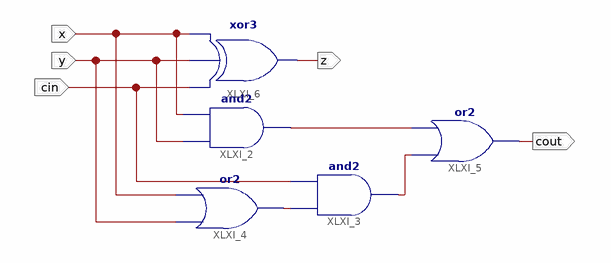
[diagram p0: schematic sheet 1]
// Xilinx ISE schematic full_adder.sch (spartan3e) as structural Verilog: 5 symbols, 5 ports
module full_adder (
  input  cin,
  input  x,
  input  y,
  output z,
  output cout
);

  wire XLXN_6, XLXN_7, XLXN_26;

  and XLXI_2 (XLXN_6, y, x);
  and XLXI_3 (XLXN_7, XLXN_26, cin);
  or XLXI_4 (XLXN_26, y, x);
  or XLXI_5 (cout, XLXN_7, XLXN_6);
  xor XLXI_6 (z, cin, y, x);
endmodule
